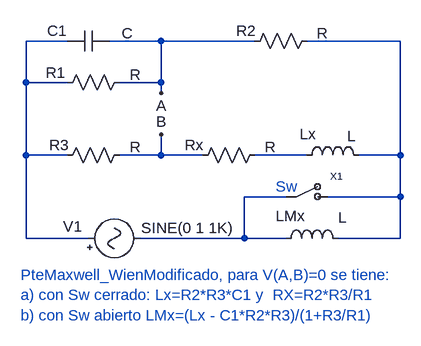
[diagram p0: schematic Lx&Mx_Maxwell_WienModificado.asc]
Lx&Mx_Maxwell_WienModificado.asc, the LTspice schematic file:
Version 4
SHEET 1 880 680
WIRE -128 208 -128 144
WIRE -128 320 -128 208
WIRE -128 448 -128 320
WIRE -64 144 -128 144
WIRE -64 208 -128 208
WIRE -64 320 -128 320
WIRE -32 448 -128 448
WIRE 80 144 0 144
WIRE 80 208 16 208
WIRE 80 208 80 144
WIRE 80 224 80 208
WIRE 80 320 16 320
WIRE 80 320 80 288
WIRE 144 320 80 320
WIRE 208 448 48 448
WIRE 208 448 208 384
WIRE 224 144 80 144
WIRE 272 384 208 384
WIRE 272 448 208 448
WIRE 304 320 224 320
WIRE 448 144 304 144
WIRE 448 320 384 320
WIRE 448 320 448 144
WIRE 448 384 336 384
WIRE 448 384 448 320
WIRE 448 448 352 448
WIRE 448 448 448 384
FLAG 80 224 A
FLAG 80 288 B
SYMBOL res 32 192 R90
WINDOW 0 16 114 VBottom 0
WINDOW 3 -12 -8 VTop 0
SYMATTR InstName R1
SYMBOL cap 0 128 R90
WINDOW 0 16 80 VBottom 0
WINDOW 3 -12 -28 VTop 0
SYMATTR InstName C1
SYMBOL ind 288 336 R270
WINDOW 0 33 18 VTop 0
WINDOW 3 61 85 VBottom 0
SYMATTR InstName Lx
SYMBOL Misc\\signal -48 448 R270
WINDOW 0 3 -8 VTop 0
WINDOW 3 32 168 VBottom 0
SYMATTR InstName V1
SYMBOL ind 256 464 R270
WINDOW 0 35 23 VTop 0
WINDOW 3 64 103 VBottom 0
SYMATTR InstName LMx
SYMBOL Pot&Sw\\switch 304 384 R0
SYMATTR InstName X1
SYMBOL res 320 128 R90
WINDOW 0 16 109 VBottom 0
WINDOW 3 -12 -8 VTop 0
SYMATTR InstName R2
SYMBOL res 32 304 R90
WINDOW 0 16 109 VBottom 0
WINDOW 3 -12 -8 VTop 0
SYMATTR InstName R3
SYMBOL res 240 304 R90
WINDOW 0 16 109 VBottom 0
WINDOW 3 -12 -8 VTop 0
SYMATTR InstName Rx
TEXT 256 368 Left 0 ;Sw
TEXT -136 504 Left 0 ;PteMaxwell_WienModificado, para V(A,B)=0 se tiene:\na) con Sw cerrado: Lx=R2*R3*C1 y  RX=R2*R3/R1\nb) con Sw abierto LMx=(Lx - C1*R2*R3)/(1+R3/R1)

The netlist it stands for:
* Lx&Mx_Maxwell_WienModificado.asc
R1 A N001 R
C1 A N001 C
Lx N003 N004 L
V1 N001 N002 SINE(0 1 1K)
LMx N002 N004 L
XX1 N002 N004 switch  ; pins 1 2
R2 N004 A R
R3 B N001 R
Rx N003 B R
* Sw
* PteMaxwell_WienModificado, para V(A,B)=0 se tiene:
* a) con Sw cerrado: Lx=R2*R3*C1 y  RX=R2*R3/R1
* b) con Sw abierto LMx=(Lx - C1*R2*R3)/(1+R3/R1)
.backanno
.end